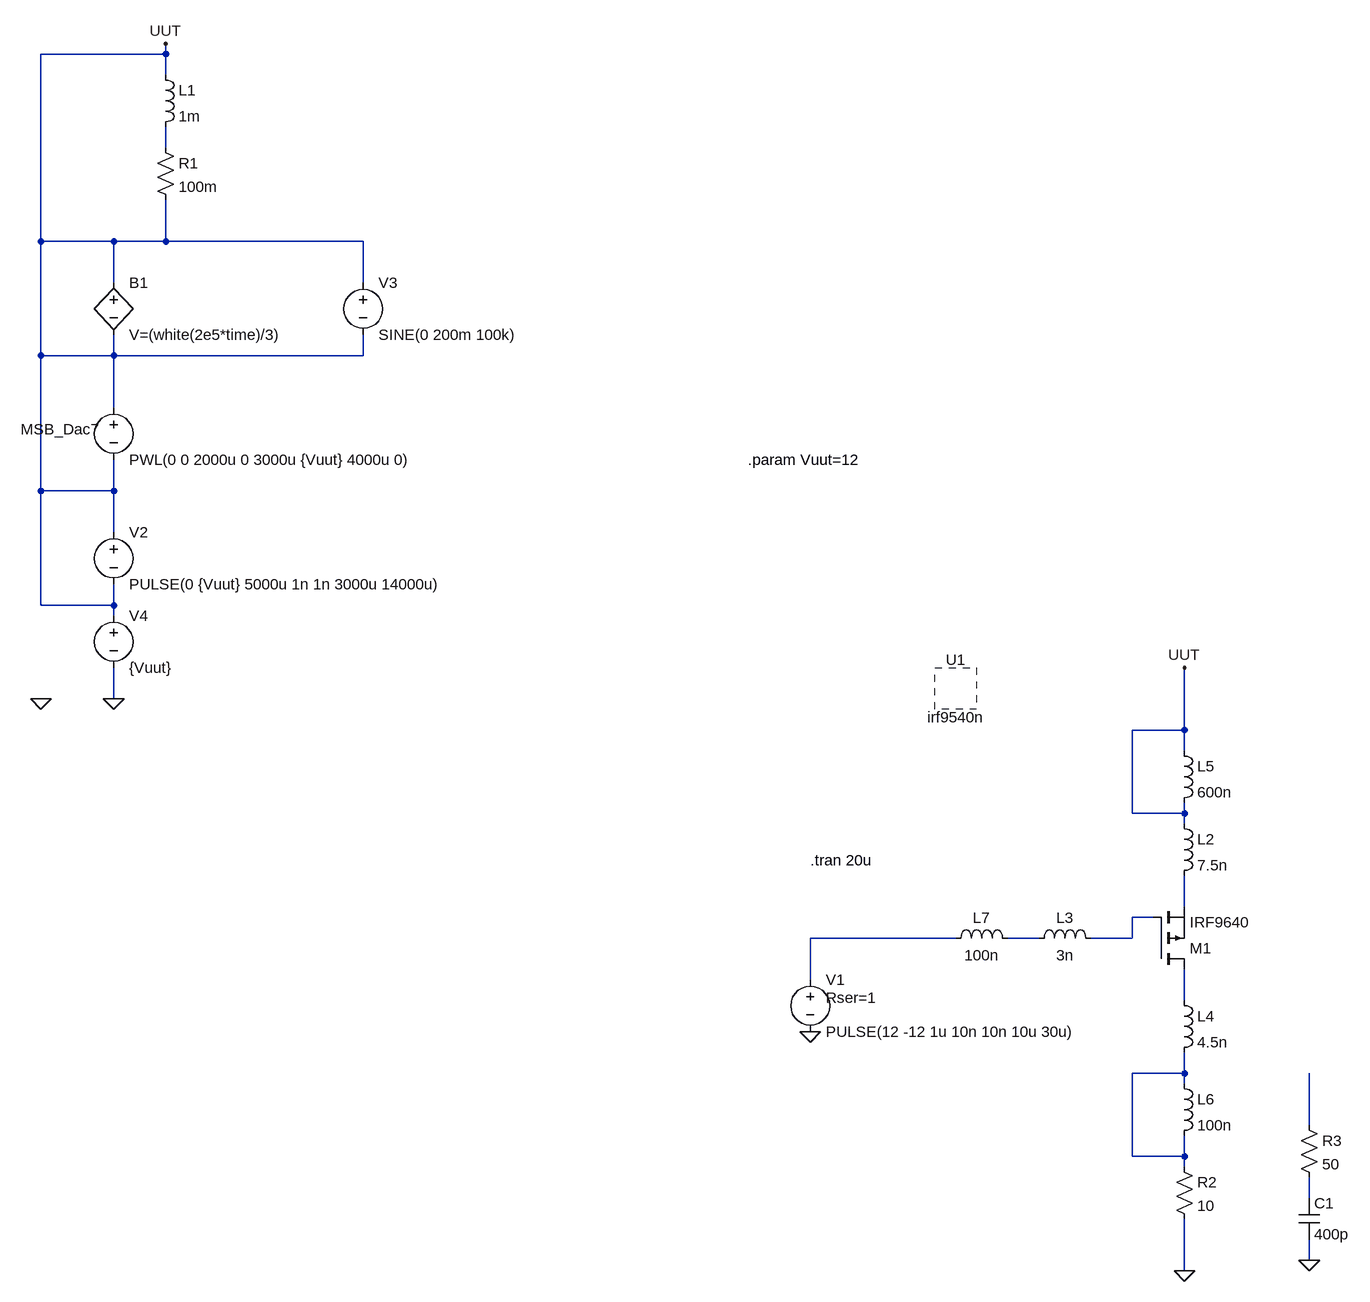
[diagram p0: schematic ringing.asc]
ringing.asc, the LTspice schematic file:
Version 4
SHEET 1 3676 2772
WIRE -288 -2064 -288 -2080
WIRE -288 -2064 -480 -2064
WIRE -288 -2032 -288 -2064
WIRE -288 -1920 -288 -1952
WIRE -480 -1776 -480 -2064
WIRE -368 -1776 -480 -1776
WIRE -288 -1776 -288 -1840
WIRE -288 -1776 -368 -1776
WIRE 16 -1776 -288 -1776
WIRE -368 -1712 -368 -1776
WIRE 16 -1712 16 -1776
WIRE -480 -1600 -480 -1776
WIRE -368 -1600 -368 -1632
WIRE -368 -1600 -480 -1600
WIRE 16 -1600 16 -1632
WIRE 16 -1600 -368 -1600
WIRE -368 -1520 -368 -1600
WIRE -480 -1392 -480 -1600
WIRE -368 -1392 -368 -1440
WIRE -368 -1392 -480 -1392
WIRE -368 -1328 -368 -1392
WIRE -480 -1216 -480 -1392
WIRE -368 -1216 -368 -1248
WIRE -368 -1216 -480 -1216
WIRE -368 -1200 -368 -1216
WIRE -368 -1072 -368 -1120
WIRE 1280 -1024 1280 -1120
WIRE 1280 -1024 1200 -1024
WIRE 1280 -992 1280 -1024
WIRE 1200 -896 1200 -1024
WIRE 1280 -896 1280 -912
WIRE 1280 -896 1200 -896
WIRE 1280 -880 1280 -896
WIRE 1280 -752 1280 -800
WIRE 1232 -736 1200 -736
WIRE 928 -704 704 -704
WIRE 1056 -704 1008 -704
WIRE 1200 -704 1200 -736
WIRE 1200 -704 1136 -704
WIRE 704 -640 704 -704
WIRE 1280 -608 1280 -656
WIRE 1280 -496 1280 -528
WIRE 1280 -496 1200 -496
WIRE 1280 -480 1280 -496
WIRE 1472 -416 1472 -496
WIRE 1200 -368 1200 -496
WIRE 1280 -368 1280 -400
WIRE 1280 -368 1200 -368
WIRE 1280 -352 1280 -368
WIRE 1472 -304 1472 -336
WIRE 1472 -208 1472 -240
WIRE 1280 -192 1280 -272
FLAG -288 -2080 UUT
FLAG -368 -1072 0
FLAG -480 -1072 0
FLAG 1280 -192 0
FLAG 1280 -1120 UUT
FLAG 704 -560 0
FLAG 1472 -208 0
SYMBOL voltage -368 -1344 R0
WINDOW 123 0 0 Left 0
WINDOW 39 0 0 Left 0
SYMATTR InstName V2
SYMATTR Value PULSE(0 {Vuut} 5000u 1n 1n 3000u 14000u)
SYMBOL bv -368 -1728 R0
SYMATTR InstName B1
SYMATTR Value V=(white(2e5*time)/3)
SYMBOL voltage 16 -1728 R0
WINDOW 123 0 0 Left 0
WINDOW 39 0 0 Left 0
SYMATTR InstName V3
SYMATTR Value SINE(0 200m 100k)
SYMBOL ind -304 -2048 R0
SYMATTR InstName L1
SYMATTR Value 1m
SYMATTR SpiceLine Rser=0
SYMBOL res -304 -1936 R0
SYMATTR InstName R1
SYMATTR Value 100m
SYMBOL voltage -368 -1216 R0
WINDOW 123 0 0 Left 0
WINDOW 39 0 0 Left 0
SYMATTR InstName V4
SYMATTR Value {Vuut}
SYMBOL voltage -368 -1536 R0
WINDOW 0 -143 49 Left 2
WINDOW 123 0 0 Left 0
WINDOW 39 0 0 Left 0
SYMATTR InstName MSB_Dac7
SYMATTR Value PWL(0 0 2000u 0 3000u {Vuut} 4000u 0)
SYMBOL EXTRA\\IRF\\PMOSFET\\irf9540n 928 -1088 R0
SYMATTR InstName U1
SYMBOL ind 1264 -896 R0
SYMATTR InstName L2
SYMATTR Value 7.5n
SYMBOL ind 1040 -688 R270
WINDOW 0 32 56 VTop 2
WINDOW 3 5 56 VBottom 2
SYMATTR InstName L3
SYMATTR Value 3n
SYMBOL ind 1264 -624 R0
SYMATTR InstName L4
SYMATTR Value 4.5n
SYMBOL voltage 704 -656 R0
WINDOW 123 0 0 Left 0
WINDOW 39 24 44 Left 2
SYMATTR InstName V1
SYMATTR Value PULSE(12 -12 1u 10n 10n 10u 30u)
SYMATTR SpiceLine Rser=1
SYMBOL res 1264 -368 R0
SYMATTR InstName R2
SYMATTR Value 10
SYMBOL ind 1264 -1008 R0
SYMATTR InstName L5
SYMATTR Value 600n
SYMBOL ind 1264 -496 R0
SYMATTR InstName L6
SYMATTR Value 100n
SYMBOL ind 912 -688 R270
WINDOW 0 32 56 VTop 2
WINDOW 3 5 56 VBottom 2
SYMATTR InstName L7
SYMATTR Value 100n
SYMBOL pmos 1232 -656 M180
SYMATTR InstName M1
SYMATTR Value IRF9640
SYMBOL res 1456 -432 R0
SYMATTR InstName R3
SYMATTR Value 50
SYMBOL cap 1456 -304 R0
SYMATTR InstName C1
SYMATTR Value 400p
TEXT 704 -824 Left 2 !.tran 20u
TEXT 608 -1440 Left 2 !.param Vuut=12

The netlist it stands for:
* ringing.asc
V2 UUT UUT PULSE(0 {Vuut} 5000u 1n 1n 3000u 14000u)
B1 UUT UUT V=(white(2e5*time)/3)
V3 UUT UUT SINE(0 200m 100k)
L1 UUT N001 1m Rser=0
R1 N001 UUT 100m
V4 UUT 0 {Vuut}
V§MSB_Dac7 UUT UUT PWL(0 0 2000u 0 3000u {Vuut} 4000u 0)
* U1: irf9540n (symbol EXTRA\IRF\PMOSFET\irf9540n not available, pin order unknown); nets seen at it: 
L2 UUT N002 7.5n
L3 N005 N003 3n
L4 N006 N007 4.5n
V1 N004 0 PULSE(12 -12 1u 10n 10n 10u 30u) Rser=1
R2 N007 0 10
L5 UUT UUT 600n
L6 N007 N007 100n
L7 N004 N005 100n
M1 N006 N003 N002 N002 IRF9640
R3 N008 N009 50
C1 N009 0 400p
.model NMOS NMOS
.model PMOS PMOS
.lib standard.mos
.tran 20u
.param Vuut=12
.backanno
.end